# EAGLE design Pre_LM358 (EAGLE 7.2.0)
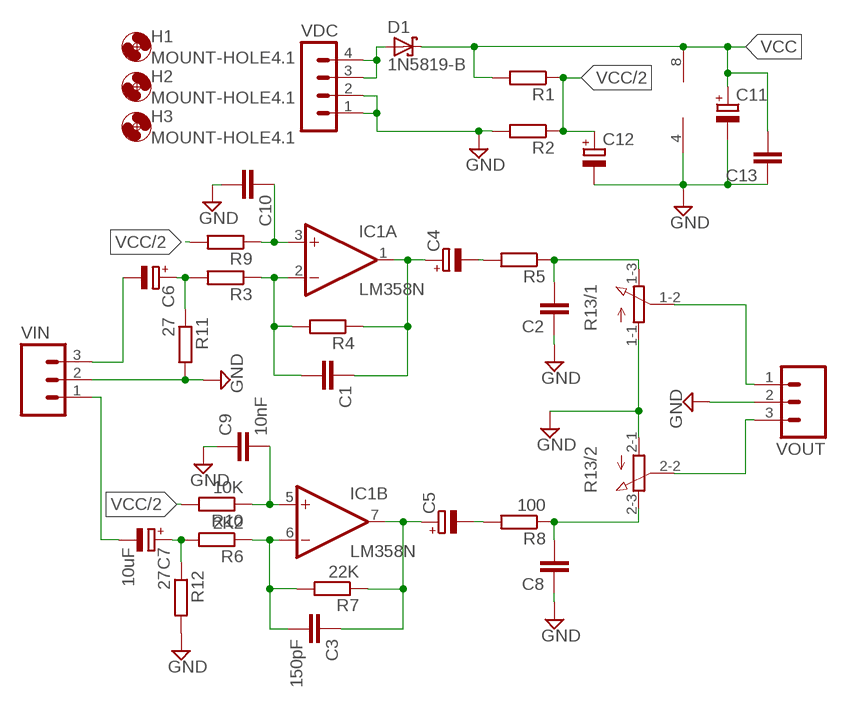
[diagram p0: schematic, sheet 1]

## Parts
C1  C-EU025-025X050  [C025-025X050]
C2  C-EU025-025X050  [C025-025X050]
C3  150pF  C-EU025-025X050  [C025-025X050]
C4  CPOL-EUE2.5-5  [E2,5-5]
C5  CPOL-EUE2.5-5  [E2,5-5]
C6  CPOL-EUE2.5-5  [E2,5-5]
C7  10uF  CPOL-EUE2.5-5  [E2,5-5]
C8  C-EU025-025X050  [C025-025X050]
C9  10nF  C-EU025-025X050  [C025-025X050]
C10  C-EU025-025X050  [C025-025X050]
C11  CPOL-EUE2.5-7  [E2,5-7]
C12  CPOL-EUE2-4  [E2-4]
C13  C-EU025-025X050  [C025-025X050]
D1  1N5819-B  [DO41-7.6]
H1  MOUNT-HOLE4.1  [4,1]
H2  MOUNT-HOLE4.1  [4,1]
H3  MOUNT-HOLE4.1  [4,1]
IC1  LM358N  [DIL08]
R1  R-EU_0207/7  [0207/7]
R2  R-EU_0207/7  [0207/7]
R3  R-EU_0207/7  [0207/7]
R4  R-EU_0207/7  [0207/7]
R5  R-EU_0207/7  [0207/7]
R6  2K2  R-EU_0207/7  [0207/7]
R7  22K  R-EU_0207/7  [0207/7]
R8  100  R-EU_0207/7  [0207/7]
R9  R-EU_0207/7  [0207/7]
R10  10K  R-EU_0207/7  [0207/7]
R11  27  R-EU_0207/7  [0207/7]
R12  27  R-EU_0207/7  [0207/7]
R13  3RP/1610G  [3RP/1610G]
VDC  MA04-1  [MA04-1]
VIN  MA03  [03P]
VOUT  MA03  [03P]

## Nets
GND: C2.1 C8.1 C9.1 C10.2 C11.- C12.- C13.1 IC1.4(P:V-) R2.2 R11.2 R12.2 R13.1-1(/1:A) R13.2-1(/2:A) VDC.1 VDC.2 VIN.2 VOUT.2
N$1: C6.+ R3.2 R11.1
N$2: C7.+ R6.2 R12.1
N$3: C1.2 IC1.2(A:-IN) R3.1 R4.2
N$4: C1.1 C4.+ IC1.1(A:OUT) R4.1
N$5: C4.- R5.2
N$6: C2.2 R5.1 R13.1-3(/1:E)
N$7: C3.1 C5.+ IC1.7(B:OUT) R7.1
N$8: C5.- R8.2
N$9: C8.2 R8.1 R13.2-3(/2:E)
N$10: C3.2 IC1.6(B:-IN) R6.1 R7.2
N$12: C7.- VIN.1
N$13: C6.- VIN.3
N$14: D1.A VDC.3 VDC.4
N$15: R13.2-2(/2:S) VOUT.3
N$16: R13.1-2(/1:S) VOUT.1
N$17: C10.1 IC1.3(A:+IN) R9.1
N$18: C9.2 IC1.5(B:+IN) R10.1
VCC: C11.+ C13.2 D1.C IC1.8(P:V+) R1.2
VCC/2: C12.+ R1.1 R2.1 R9.2 R10.2

## Library data of the parts
C1-C3 C8-C10 C13 = rcl:C-EU: CAPACITOR, European symbol
C4-C7 = rcl:CPOL-EU: POLARIZED CAPACITOR, European symbol
C11 C12 = resistor:CPOL-EU: POLARIZED CAPACITOR, European symbol
D1 = diode:1N581*: 1.0A SCHOTTKY BARRIER RECTIFIER Source: http://www.diodes.com/datasheets/ds23001.pdf
H1-H3 = holes:MOUNT-HOLE: MOUNTING HOLE with drill center marker
IC1 = linear:LM358: OP AMP also LM158; LM258; LM2904 Source: http://cache.national.com/ds/LM/LM158.pdf
R1-R12 = resistor:R-EU_: RESISTOR, European symbol
R13 = pot:3RP/1610G: 16mm Potentiometer two level Source: http://www.alphapotentiometers.net/html/16mm_pot_2.html
VDC = con-lstb:MA04-1: PIN HEADER; OC_FARNELL: unknown; OC_NEWARK: unknown
VIN VOUT = con-amp-quick:MA03: AMP QUICK CONNECTOR; OC_FARNELL: unknown; OC_NEWARK: unknown

## Board
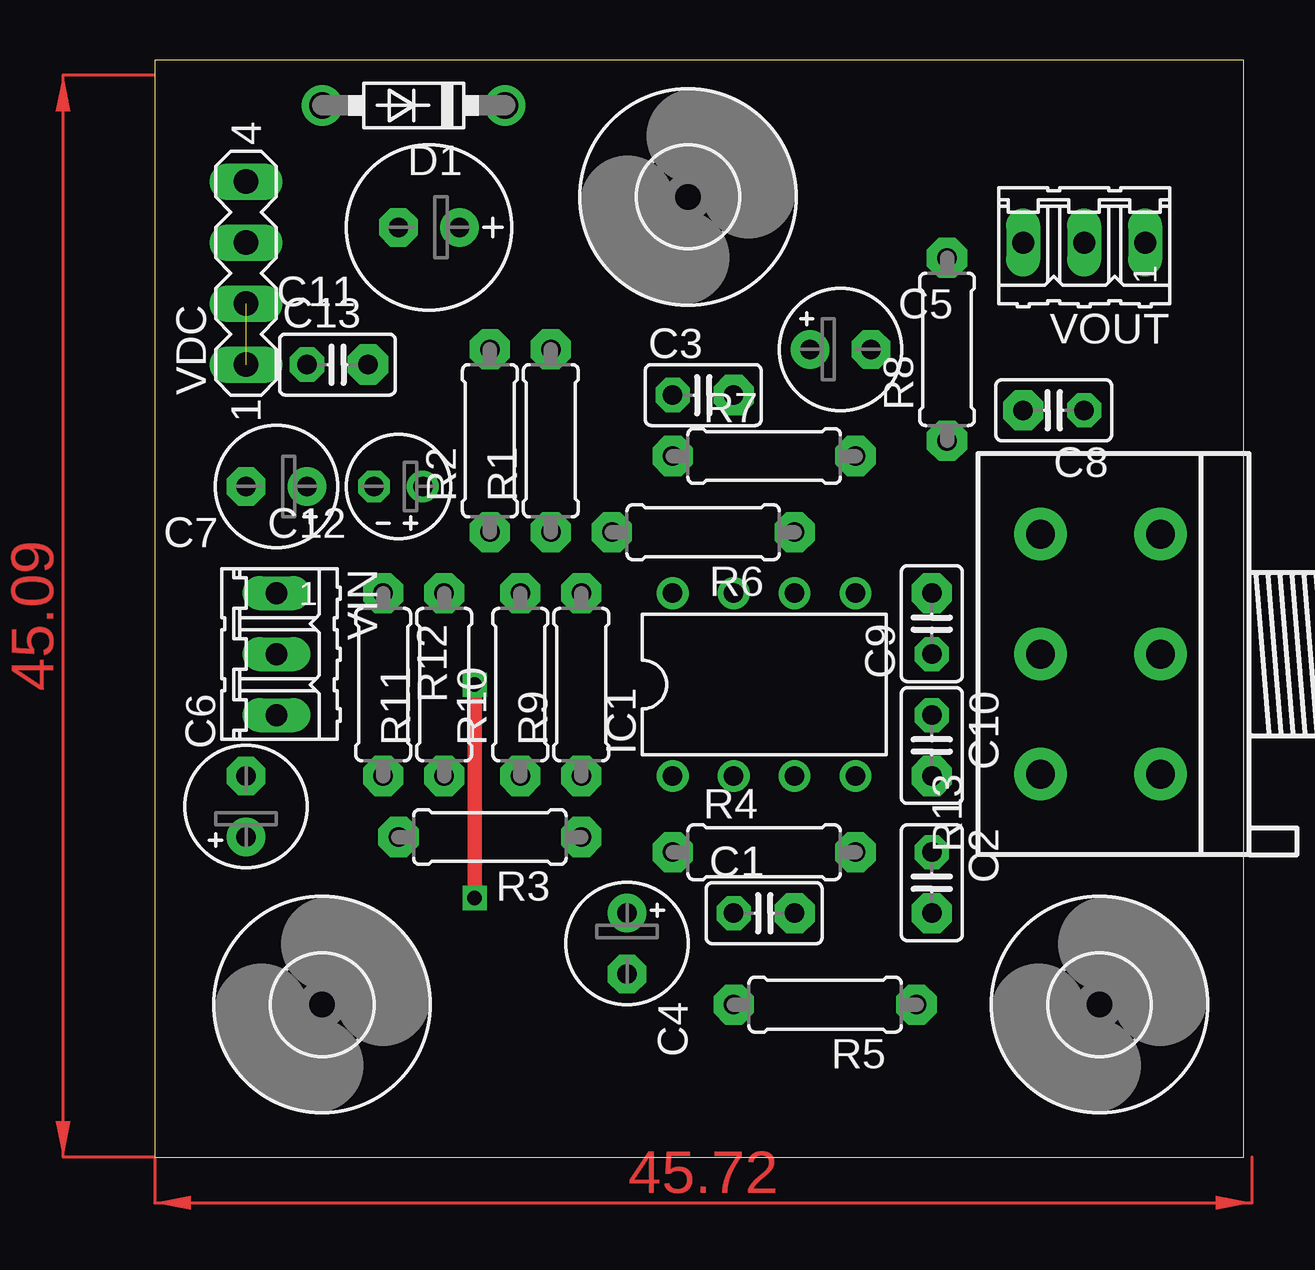
[diagram p1: board, top side]
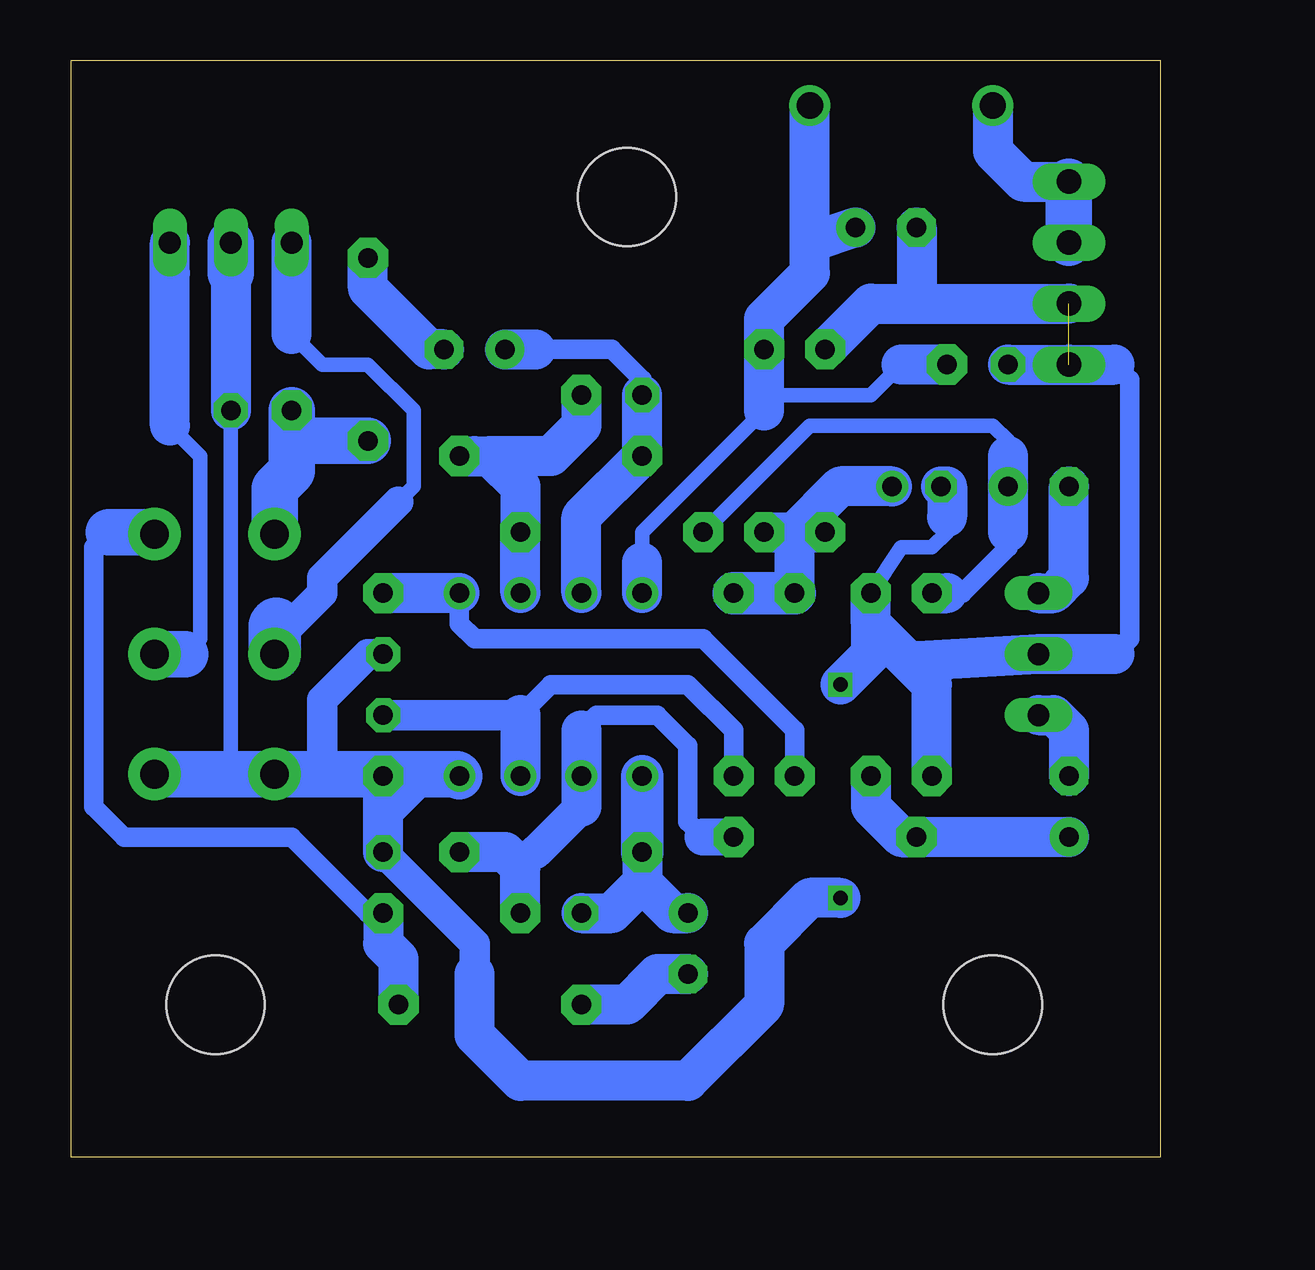
[diagram p2: board, bottom side, seen from below]

Size 45.39 x 45.71 mm. Coordinates in mm from the lower left corner, seen from the top.
Outline: 0,0 45.39,0 45.39,45.71 0,45.71 0,0
Copper layers (1*16): Top 0.035mm / dielectric 1.5mm / Bottom 0.035mm
Design rules "default": minimum track width 10mil, minimum drill 24mil, track to track 8mil, track to pad 8mil, pad to pad 8mil, via to via 8mil, smd to smd 8mil, copper to edge 40mil, drill to drill 8mil, minimum pad ring 10mil, minimum via ring 8mil, stop-mask expansion 4mil, vias tented up to drill 0mil, thermal gap 10mil

### Footprints (pad centres in the part's own frame; a part is rotated, then mirrored left to right if it is on the bottom)
C025-025X050 = drill 0.813 pad 1.422 octagon: 1 -1.27,0 | drill 0.813 pad 1.676 octagon: 2 1.27,0
E2,5-5 = drill 0.813 pad 1.6: + -1.27,0 | drill 0.813 pad 1.6 octagon: - 1.27,0
E2,5-7 = drill 0.813 pad 1.6: + -1.27,0 | drill 0.813 pad 1.6 octagon: - 1.27,0
E2-4 = drill 0.813 pad 1.27: + -1.016,0 | drill 0.813 pad 1.27 octagon: - 1.016,0
DO41-7.6 = drill 1.1 pad 1.7: A 3.81,0; C -3.81,0
4,1 = hole 4.1: 0,0
DIL08 = drill 0.813 pad 1.27: 1 -3.81,-3.81; 2 -1.27,-3.81; 3 1.27,-3.81; 4 3.81,-3.81; 5 3.81,3.81; 6 1.27,3.81; 7 -1.27,3.81; 8 -3.81,3.81
0207/7 = drill 0.813 pad 1.676 octagon: 1 -3.81,0; 2 3.81,0
3RP/1610G = drill 1.2 pad 2.184: 1-1 -5,0; 1-2 0,0; 1-3 5,0; 2-1 -5,5; 2-2 0,5; 2-3 5,5
MA04-1 = drill 1.016 long: 1 -3.81,0; 2 -1.27,0; 3 1.27,0; 4 3.81,0
03P = drill 0.914 long: 1 -2.54,0; 2 0,0; 3 2.54,0

### Placement (x,y rotation side)
C1  25.4,10.16 0 top
C2  32.38,11.43 270 top
C3  22.86,31.75 0 top
C4  19.69,8.89 270 top
C5  28.57,33.66 0 top
C6  3.81,14.61 90 top
C7  5.08,27.94 180 top
C8  37.46,31.11 180 top
C9  32.38,22.22 90 top
C10  32.38,17.14 270 top
C11  11.43,38.73 180 top
C12  10.16,27.94 180 top
C13  7.62,33.02 0 top
D1  10.79,43.82 180 top
H1  6.98,6.35 0 top
H2  22.23,40.01 0 top
H3  39.37,6.35 0 top
IC1  25.4,19.68 0 top
R1  16.51,29.84 90 top
R2  13.97,29.84 90 top
R3  13.97,13.34 180 top
R4  25.4,12.7 0 top
R5  27.94,6.35 180 top
R6  22.86,26.04 180 top
R7  25.4,29.21 0 top
R8  33.02,33.66 90 top
R9  17.78,19.68 90 top
R10  15.24,19.68 90 top
R11  12.06,19.68 90 top
R12  9.53,19.68 270 top
R13  41.91,20.95 90 top
VDC  3.81,36.83 90 top
VIN  5.08,20.95 270 top
VOUT  38.73,38.1 180 top

### Tracks (layer width: path | path; a pad name or v marks a point on that pad's centre or on a via)
GND  (via drill 0.6)  (1 unrouted)
  Top 0.61: v13.33,19.68 v13.33,10.79
  Bottom 0.61: C8.1 38.73,15.96 35.56,15.96 | 8.89,26.67 8.89,26.04 9.53,25.4 10.79,25.4 R11.2
  Bottom 0.813: C10.2 IC1.4 | 1.9,33.02 1.27,32.39 1.27,21.59 1.9,20.95
  Bottom 1.016: IC1.4 30.48,15.88 32.38,13.97
  Bottom 1.27: 32.46,15.96 34.84,15.96 34.92,15.88 34.92,19.05 33.02,20.95 C9.1 | 28.57,7.62 28.57,8.89 C2.1
  Bottom 1.676: VOUT.2 C8.1 | C2.1 32.38,13.97 C10.2 | C13.1 VDC.1 1.9,33.02 | C12.- 8.89,27.94 8.89,26.67 | R2.2 12.06,35.56 10.16,35.56 | 10.16,35.56 VDC.2 | C11.- 10.16,35.56 | R12.2 9.53,19.68 10.48,20.64 | 10.48,20.64 12.06,22.22 | 12.06,22.22 R11.2 | 10.48,20.64 VIN.2 1.9,20.95 | 12.06,22.22 12.06,20.95 v13.33,19.68 | v13.33,10.79 14.6,10.79 16.51,8.89 16.51,6.35 19.69,3.17 26.67,3.17 28.57,5.08 28.57,7.62
  Bottom 1.93: R13.1-1 38.73,15.96 R13.2-1 35.56,15.96 32.46,15.96 | 32.46,15.96 C10.2 | 32.46,15.96 29.29,15.96 IC1.4 | 38.73,36.83 VOUT.2
N$1
  Bottom 1.676: C6.+ R3.2 10.79,13.34 12.06,14.61 R11.1
N$2
  Bottom 0.61: 6.35,29.21 6.35,29.84 6.98,30.48 14.6,30.48 R6.2
  Bottom 0.813: 8.89,23.49 8.26,23.49 6.35,25.4 6.35,26.04
  Bottom 1.676: 6.35,29.21 C7.+ 6.35,26.04 | R12.1 8.89,23.49
N$3
  Bottom 0.813: IC1.2 24.13,15.24 | 26.03,12.7 27.3,12.7 | 19.05,13.34 19.69,13.97 19.69,17.14 20.95,18.41 23.49,18.41 24.13,17.78
  Bottom 1.422: 24.13,14.61 26.03,12.7
  Bottom 1.532: R3.1 19.05,13.34
  Bottom 1.676: C1.2 26.67,12.06 27.3,12.7 R4.2 | 24.13,14.61 24.13,15.24 24.13,17.78
N$4
  Bottom 1.676: R4.1 21.59,11.43 | 21.59,11.43 20.32,10.16 C4.+ | C1.1 22.86,10.16 21.59,11.43
  Bottom 1.778: R4.1 IC1.1
N$5
  Bottom 1.676: C4.- 20.95,7.62 22.23,6.35 R5.2
N$6
  Bottom 0.813: C2.2 33.02,10.16 36.2,13.34 43.18,13.34 44.45,14.61 44.45,25.4 43.81,26.04
  Bottom 1.676: C2.2 32.38,8.89 31.75,8.26 R5.1
  Bottom 1.93: 43.81,26.04 41.99,26.04 R13.1-3
N$7
  Bottom 0.813: 26.03,33.66 22.86,33.66 21.59,32.39 C3.1
  Bottom 1.676: IC1.7 24.13,26.67 R7.1 C3.1 | C5.+ 26.03,33.66
N$8
  Bottom 1.676: C5.- 30.48,33.66 33.02,36.2 R8.2
N$9
  Bottom 1.93: R13.2-3 36.91,27.86 36.2,28.57 36.2,29.84 | 36.2,29.84 C8.2 | R8.1 36.2,29.84
N$10
  Bottom 1.676: IC1.6 R6.1 26.67,27.94 27.94,29.21 | R7.2 28.57,29.21 27.94,29.21 | C3.2 24.13,30.48 25.4,29.21 27.94,29.21
N$11  (via drill 0.6)
  other vias: 13.33,10.79
N$12
  Bottom 1.676: VIN.1 4.44,23.49 3.81,24.13 C7.-
N$13
  Bottom 1.676: VIN.3 4.44,18.41 3.81,17.78 C6.-
N$14
  Bottom 1.676: D1.A 6.98,41.91 5.71,40.64 VDC.4
  Bottom 1.93: VDC.3 VDC.4
N$15
  Bottom 0.61: 31.75,27.3 31.11,27.94 31.11,31.11 33.02,33.02 34.92,33.02 36.2,34.29
  Bottom 1.27: 36.83,22.22 36.2,22.22 34.92,23.49 34.92,24.13 31.75,27.3
  Bottom 1.676: 36.2,34.29 VOUT.3 36.2,36.83
  Bottom 2.184: R13.2-2 36.91,22.14 36.83,22.22
N$16
  Bottom 0.61: 40.64,20.95 40,21.59 40,29.21 41.27,30.48
  Bottom 1.676: 41.27,36.83 VOUT.1 41.27,30.48
  Bottom 1.93: R13.1-2 40.64,20.95
N$17
  Bottom 0.813: R9.1 17.78,17.78 19.69,19.68 25.4,19.68 26.67,18.41
  Bottom 1.27: C10.1 26.67,18.41
  Bottom 1.676: 26.67,18.41 IC1.3
N$18
  Bottom 0.813: R10.1 15.24,17.78 19.05,21.59 28.57,21.59 29.21,22.22 IC1.5
  Bottom 1.676: IC1.5 C9.2
VCC
  Bottom 0.61: 21.59,24.76 21.59,26.04 16.51,31.11 | 10.79,33.02 12.06,31.75 15.87,31.75 16.51,32.39
  Bottom 1.676: 14.6,38.1 14.6,36.83 16.51,34.93 R1.2 16.51,32.39 16.51,31.11 | 14.6,38.1 D1.C | C11.+ 14.6,38.1 | IC1.8 21.59,24.76 | C13.2 10.79,33.02
VCC/2
  Bottom 1.676: R1.1 15.24,26.04 | 15.24,26.04 R2.1 | R10.2 15.24,26.04 | C12.+ 13.33,27.94 15.24,26.04
  Bottom 1.778: R10.2 R9.2
(copper drawn outside any net)
  shapes: Top area x2